# Altium project Domotica.PrjPcb
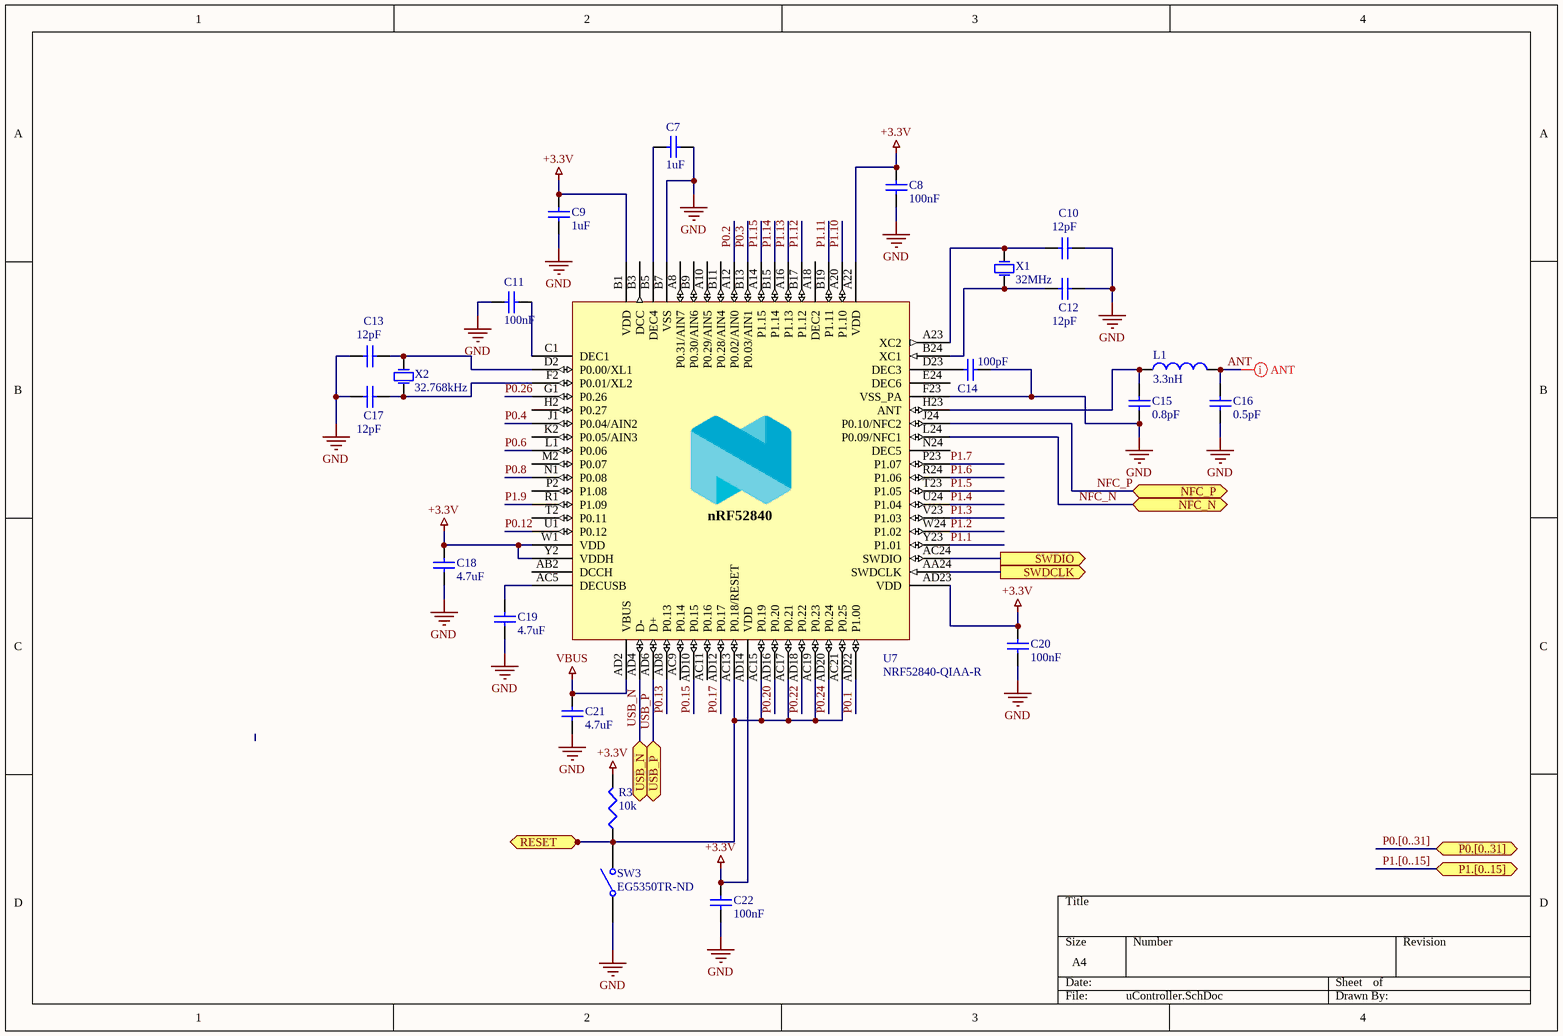
[diagram p0: uController.SchDoc]
3 sheets, 43 parts. Net scope: flat (ports and power ports of the same name join across sheets).
Board file: PCB.PcbDoc
Sheets:
  uController.SchDoc
  Power.SchDoc
  Output.SchDoc

## Sheet uController.SchDoc
size A4

### Parts
C7  value 1uF  (hidden comment: CL10A105KA8NNNC)
C8  value 100nF  (hidden comment: CL05A104KA5NNNC)
C9  value 1uF  (hidden comment: CL10A105KA8NNNC)
C10  value 12pF  (hidden comment: CL10C120JB8NNNC)
C11  value 100nF  (hidden comment: CL05A104KA5NNNC)
C12  value 12pF  (hidden comment: CL10C120JB8NNNC)
C13  value 12pF  (hidden comment: CL10C120JB8NNNC)
C14  value 100pF  (hidden comment: 885012206028)
C15  value 0.8pF  (hidden comment: CL10C0R8BB8NNNC)
C16  value 0.5pF  (hidden comment: CL10C0R5BB8NNNC)
C17  value 12pF  (hidden comment: CL10C120JB8NNNC)
C18  value 4.7uF  (hidden comment: CL21A475KAQNNNE)
C19  value 4.7uF  (hidden comment: CL21A475KAQNNNE)
C20  value 100nF  (hidden comment: CL05A104KA5NNNC)
C21  value 4.7uF  (hidden comment: CL21A475KAQNNNE)
C22  value 100nF  (hidden comment: CL05A104KA5NNNC)
L1  value 3.3nH  (hidden comment: CIH05T3N3SNC)
R3  value 10k  (hidden comment: RR0816P-103-D)
SW3  EG5350TR-ND  [SW1]
U7  NRF52840-QIAA-R
X1  value 32MHz  (hidden comment: NX2016SA-32MHZ-EXS00A-CS11336)
X2  value 32.768kHz  (hidden comment: Q0,032768-JTX210-9-20-T1-80K-LF)

### Ports
NFC_N, NFC_P, P0.[0..31] (bidir), P1.[0..15] (bidir), RESET (out), SWDCLK (out), SWDIO (out), USB_N, USB_P

### Nets
+3.3V: C8.1 C9.2 C18.2 C20.1 C22.1 R3.2 U7.A22(VDD) U7.AD14(VDD) U7.AD23(VDD) U7.B1(VDD) U7.W1(VDD) U7.Y2(VDDH)
GND: C7.1 C8.2 C9.1 C10.2 C11.2 C12.2 C13.1 C14.2 C15.1 C16.2 C17.1 C18.1 C19.1 C20.2 C21.1 C22.2 SW3.1 U7.B7(VSS) U7.F23(VSS_PA) X1.1(GND) X1.3(GND)
VBUS: C21.2 U7.AD2(VBUS)
ANT: C16.1 L1.2
NFC_N: U7.L24(P0.09/NFC1) ; port NFC_N
NFC_P: U7.J24(P0.10/NFC2) ; port NFC_P
P0.1: U7.AD22(P1.00)
P0.2: U7.A12(P0.02/AIN0)
P0.3: U7.B13(P0.03/AIN1)
P0.4: U7.J1(P0.04/AIN2)
P0.6: U7.L1(P0.06)
P0.8: U7.N1(P0.08)
P0.12: U7.U1(P0.12)
P0.13: U7.AD8(P0.13)
P0.15: U7.AD10(P0.15)
P0.17: U7.AD12(P0.17)
P0.20: U7.AD16(P0.20)
P0.22: U7.AD18(P0.22)
P0.24: U7.AD20(P0.24)
P0.26: U7.G1(P0.26)
P1.1: U7.Y23(P1.01)
P1.2: U7.W24(P1.02)
P1.3: U7.V23(P1.03)
P1.4: U7.U24(P1.04)
P1.5: U7.T23(P1.05)
P1.6: U7.R24(P1.06)
P1.7: U7.P23(P1.07)
P1.9: U7.R1(P1.09)
P1.10: U7.A20(P1.10)
P1.11: U7.B19(P1.11)
P1.12: U7.B17(P1.12)
P1.13: U7.A16(P1.13)
P1.14: U7.B15(P1.14)
P1.15: U7.A14(P1.15)
USB_N: U7.AD4(D-) ; port USB_N
USB_P: U7.AD6(D+) ; port USB_P
NetC7_2: C7.2 U7.B5(DEC4)
NetC10_1: C10.1 U7.A23(XC2) X1.4(OSC2)
NetC11_1: C11.1 U7.C1(DEC1)
NetC12_1: C12.1 U7.B24(XC1) X1.2(OSC1)
NetC13_2: C13.2 U7.D2(P0.00/XL1) X2.2(OSC2)
NetC14_1: C14.1 U7.D23(DEC3)
NetC15_2: C15.2 L1.1 U7.H23(ANT)
NetC17_2: C17.2 U7.F2(P0.01/XL2) X2.1(OSC1)
NetC19_2: C19.2 U7.AC5(DECUSB)
NetJ3_6: R3.1 SW3.3 U7.AC13(P0.18/RESET) U7.AC15(P0.19) U7.AC17(P0.21) U7.AC19(P0.23) U7.AC21(P0.25) ; port RESET
NetJ3_9: U7.AA24(SWDCLK) ; port SWDCLK
NetJ3_10: U7.AC24(SWDIO) ; port SWDIO

Not connected (* = marked no-connect by the designer): SW3 2 4; U7 A8(P0.31/AIN7) A10(P0.29/AIN5) A18(DEC2) AB2(DCCH) AC9(P0.14) AC11(P0.16) B3(DCC) B9(P0.30/AIN6) B11(P0.28/AIN4) E24(DEC6) H2(P0.27) K2(P0.05/AIN3) M2(P0.07) N24(DEC5) P2(P1.08) T2(P0.11)

### Buses and harness runs
bus P0.[0..31] = port P0.[0..31]
bus P1.[0..15] = port P1.[0..15]

### Layout directives
net class ANT: ANT

### Notes on the sheet
- (in symbol NRF52840-QIAA-R) nRF52840

### Library data of the parts
C7 C9 = CL10A105KA8NNNC: Cap Ceramic 1uF 25V X5R 10% SMD 0603 85C Paper T/R; Manufacturer: Samsung; Supplier 1: Digi-Key; Manufacturer Part Number: CL10A105KA8NNNC; Stock 1: 40000; Pricing 1: 1=0.1, 10=0.052, 100=0.0231, 500=0.0165, 1000=0.013 (USD); Mount: Surface Mount; Case/Package: 0603; Case Code (Metric): 1608; Case Code (Imperial): 0603; Material: Ceramic; Contact Plating: Tin; Min Operating Temperature: -55°C; Max Operating Temperature: 85°C; Capacitance: 1uF; Tolerance: 10%; Dielectric: X5R; Voltage: 25V; Voltage Rating (DC): 25V; Packaging: Tape and Reel; Package Quantity: 1; Voltage Rating: 25V; Length: 1.6mm; Height: 0.8mm; Depth: 0.8mm; Width: 0.031inch; Thickness: 0.035inch; Radiation Hardening: No; Lead Free: Lead Free; Supplier Part Number 1: 1276-1102-1-ND
C8 C11 C20 C22 = CL05A104KA5NNNC: Cap Ceramic 0.1uF 25V X5R 10% SMD 0402 85C Paper T/R; Manufacturer: Samsung; Supplier 1: Digi-Key; Manufacturer Part Number: CL05A104KA5NNNC; Stock 1: 100000; Pricing 1: 1=0.1, 10=0.04, 100=0.0176, 500=0.0126, 1000=0.0099, 2500=0.009, 5000=0.0083 (USD); Mount: Surface Mount; Case/Package: 0402; Case Code (Metric): 1005; Case Code (Imperial): 0402; Min Operating Temperature: -55°C; Max Operating Temperature: 85°C; Capacitance: 100nF; Packaging: Tape and Reel; Tolerance: 10%; Package Quantity: 1; Voltage Rating: 25V; Dielectric: X5R; Voltage: 25V; Voltage Rating (DC): 25V; Length: 1mm; Height: 0.5mm; Width: 0.02inch; Thickness: 0.022inch; Depth: 0.5mm; Radiation Hardening: No; Lead Free: Lead Free; Supplier Part Number 1: 1276-1043-1-ND
C10 C12 C13 C17 = CL10C120JB8NNNC: Cap Ceramic 12pF 50V C0G 5% SMD 0603 125C Paper T/R; Manufacturer: Samsung; Temperature Coefficient: 300ppm/°C; Supplier 1: Digi-Key; Manufacturer Part Number: CL10C120JB8NNNC; Stock 1: 40000; Pricing 1: 1=0.1, 10=0.07, 100=0.0314, 500=0.0224, 1000=0.0176 (USD); Mount: Surface Mount; Case/Package: 0603; Case Code (Metric): 1608; Case Code (Imperial): 0603; Material: Ceramic; Contact Plating: Tin; Min Operating Temperature: -55°C; Max Operating Temperature: 125°C; Tolerance: 5%; Capacitance: 12pF; Dielectric: C0G; Voltage: 50V; Voltage Rating (DC): 50V; Voltage Rating: 50V; Package Quantity: 1; Packaging: Tape and Reel; Length: 1.6mm; Height: 0.8mm; Depth: 0.8mm; Width: 0.031inch; Thickness: 0.035inch; Radiation Hardening: No; Lead Free: Lead Free; Supplier Part Number 1: 1276-1254-1-ND
C14 = 885012206028: Wurth Elektronik 0603 WCAP-CSGP 100pF Ceramic Multilayer Capacitor, 16 V dc, +125°C, X7R Dielectric, ±10%; Manufacturer: Wurth Electronics; Voltage Rating: 16V; Supplier 1: Digi-Key; Manufacturer Part Number: 885012206028; Stock 1: 4208; Pricing 1: 1=0.1, 10=0.021, 100=0.0192, 500=0.017 (USD); Mount: Surface Mount; Case/Package: 0603; Case Code (Metric): 1608; Case Code (Imperial): 0603; Min Operating Temperature: -55°C; Max Operating Temperature: 125°C; Packaging: Tape and Reel; Capacitance: 100pF; Tolerance: 10%; Length: 0.063inch; Width: 0.031inch; Thickness: 0.034inch; Supplier Part Number 1: 732-7947-1-ND
C15 = CL10C0R8BB8NNNC: Cap Ceramic 0.8pF 50V C0G 0.1pF SMD 0603 125C Paper T/R; Manufacturer: Samsung; Supplier 1: Digi-Key; Manufacturer Part Number: CL10C0R8BB8NNNC; Stock 1: 40000; Pricing 1: 1=0.1, 10=0.059, 100=0.0264, 500=0.0189, 1000=0.0148 (USD); Mount: Surface Mount; Case/Package: 0603; Case Code (Metric): 1608; Case Code (Imperial): 0603; Min Operating Temperature: -55°C; Max Operating Temperature: 125°C; Capacitance: 0.8pF; Packaging: Tape and Reel; Package Quantity: 1; Voltage Rating: 50V; Dielectric: C0G; Voltage Rating (DC): 50V; Length: 1.6mm; Height: 0.8mm; Width: 0.031inch; Thickness: 0.035inch; Depth: 0.8mm; Radiation Hardening: No; Supplier Part Number 1: 1276-2148-1-ND
C16 = CL10C0R5BB8NNNC: Cap Ceramic 0.5pF 50V C0G 0.1pF SMD 0603 125C Paper T/R; Manufacturer: Samsung; Dielectric: NP0; Temperature Coefficient: 300ppm/°C; Supplier 1: Digi-Key; Manufacturer Part Number: CL10C0R5BB8NNNC; Stock 1: 28897; Pricing 1: 1=0.1, 10=0.049, 100=0.0217, 500=0.0155, 1000=0.0122 (USD); Mount: Surface Mount; Case/Package: 0603; Case Code (Metric): 1608; Case Code (Imperial): 0603; Material: Ceramic; Contact Plating: Matte,Tin; Min Operating Temperature: -55°C; Max Operating Temperature: 125°C; Voltage Rating: 50V; Package Quantity: 1; Packaging: Tape and Reel; Capacitance: 0.5pF; Voltage: 50V; Length: 1.6mm; Height: 0.8mm; Width: 0.031inch; Thickness: 0.035inch; Depth: 0.8mm; Radiation Hardening: No; Supplier Part Number 1: 1276-1818-1-ND
C18 C19 C21 = CL21A475KAQNNNE: Cap Ceramic 4.7uF 25V X5R 10% SMD 0805 85C Embossed T/R; Manufacturer: Samsung; Supplier 1: Digi-Key; Manufacturer Part Number: CL21A475KAQNNNE; Stock 1: 20000; Pricing 1: 1=0.23, 10=0.158, 100=0.0802, 500=0.0549, 1000=0.0485 (USD); Mount: Surface Mount; Case/Package: 0805; Case Code (Metric): 2012; Case Code (Imperial): 0805; Min Operating Temperature: -55°C; Max Operating Temperature: 85°C; Package Quantity: 1; Packaging: Tape and Reel; Capacitance: 4.7uF; Tolerance: 10%; Voltage Rating: 25V; Dielectric: X5R; Voltage Rating (DC): 25V; Length: 2mm; Height: 1.25mm; Width: 0.049inch; Thickness: 0.055inch; Depth: 1.25mm; Radiation Hardening: No; Lead Free: Lead Free; Supplier Part Number 1: 1276-1244-1-ND
L1 = CIH05T3N3SNC: Inductor High Frequency Chip Multi-Layer 3.3nH 0.3nH 100MHz 8Q-Factor Ceramic 300mA 190mOhm DCR 0402 T/R; Manufacturer: Samsung; Shielding: Unshielded; DC Resistance (DCR): 190mR; Self Resonant Frequency: 6GHz; Supplier 1: Digi-Key; Manufacturer Part Number: CIH05T3N3SNC; Stock 1: 68140; Pricing 1: 1=0.1, 10=0.015, 100=0.0102, 500=0.0082, 1000=0.007, 2500=0.0063 (USD); Mount: Surface Mount; Case/Package: 0402; Case Code (Metric): 1005; Case Code (Imperial): 0402; Core Material: Ceramic; Min Operating Temperature: -55°C; Max Operating Temperature: 125°C; Packaging: Cut Tape; Current Rating: 300mA; Inductance: 3.3nh; Test Frequency: 100MHz; Max DC Current: 300mA; DC Current: 300mA; Military Standard: Not; Length: 0.039inch; Height: 0.55mm; Width: 0.02inch; Depth: 0.55mm; Radiation Hardening: No; Lead Free: Lead Free; Supplier Part Number 1: 1276-6294-1-ND
R3 = RR0816P-103-D: RES SMD 10K OHM 0.5% 1/16W 0603; Manufacturer: Susumu; Power (Watts): 0.063W, 1/16W; Temperature Coefficient: ±25ppm/°C; Supplier 1: Digi-Key; Manufacturer Part Number: RR0816P-103-D; RoHS: RoHS Compliant; Category: Resistors; Stock 1: 362461; Pricing 1: 1=0.09, 10=0.084, 100=0.0321, 1000=0.01412, 2500=0.01219 (EUR); Packaging: Cut Tape (CT); Part Status: Active; Tolerance: ±0.5%; Composition: Thin Film; Features: -; Operating Temperature: -55°C ~ 125°C; Package / Case: 0603 (1608 Metric); Supplier Device Package: -; Size / Dimension: 0.063" L x 0.032" W (1.60mm x 0.80mm); Height - Seated (Max): 0.020" (0.50mm); Failure Rate: -; ComponentLink1URL: http://www.susumu.co.jp/common/pdf/n_catalog_partition05_en.pdf; ComponentLink1Description: http://www.susumu.co.jp/common/pdf/n_catalog_partition05_en.pdf; Supplier Part Number 1: RR08P10.0KDCT-ND
SW3 = TL3305AF160QG: SWITCH TACTILE SPST-NO 50MA 12V; Manufacturer: E-Switch; Switch Function: Off-Mom; Contact Rating @ Voltage: 0.05A @ 12VDC; Actuator Type: Standard; Actuator Height off PCB, Vertical: 3.80mm; Actuator Orientation: Top Actuated; Outline: 4.50mm x 4.50mm; Illumination: Non-Illuminated; Operating Force: 160gf; Switch Travel: 0.20mm; Mechanical Life: 500,000 Cycles; Checked: 0; Supplier 1: Digi-Key; Manufacturer Part Number: TL3305AF160QG; RoHS: RoHS Compliant; Category: Switches; Stock 1: 50000; Pricing 1: 2000=0.08803, 6000=0.07294 (EUR); Packaging: Tape & Reel (TR); Part Status: Active; Circuit: SPST-NO; Mounting Type: Surface Mount; Actuator Length, Right Angle: -; Termination Style: Gull Wing; Illumination Type, Color: -; Illumination Voltage (Nominal): -; Ingress Protection: -; Features: -; Operating Temperature: -20°C ~ 70°C; Actuator Material: -; ComponentLink1URL: http://spec_sheets.e-switch.com/specs/P010468.pdf; ComponentLink1Description: http://spec_sheets.e-switch.com/specs/P010468.pdf; Supplier Part Number 1: EG5350TR-ND
U7 = NRF52840-QIAA-R: Manufacturer: Nordic Semiconductor; Supplier 1: Digi-Key; Manufacturer Part Number: NRF52840-QIAA-R; Stock 1: 13083; Pricing 1: 1=7.43, 10=6.815, 25=6.1952, 100=5.5755, 250=5.1109, 500=4.6463, 1000=4.1816 (USD); Supplier Part Number 1: 1490-1071-1-ND
X1 = NX2016SA-32MHZ-EXS00A-CS11336: Manufacturer: NDK; Supplier 1: Digi-Key; Manufacturer Part Number: NX2016SA-32MHZ-EXS00A-CS11336; Stock 1: 2762; Pricing 1: 1=0.64, 10=0.531, 50=0.4776, 100=0.4246, 500=0.4034, 1000=0.3397 (USD); Supplier Part Number 1: 644-1324-1-ND
X2 = Q0,032768-JTX210-9-20-T1-80K-LF: Manufacturer: Jauch; Supplier 1: Digi-Key; Manufacturer Part Number: Q0,032768-JTX210-9-20-T1-80K-LF; Stock 1: 0; Supplier Part Number 1: 1908-1304-2-ND

## Sheet Power.SchDoc
size A4
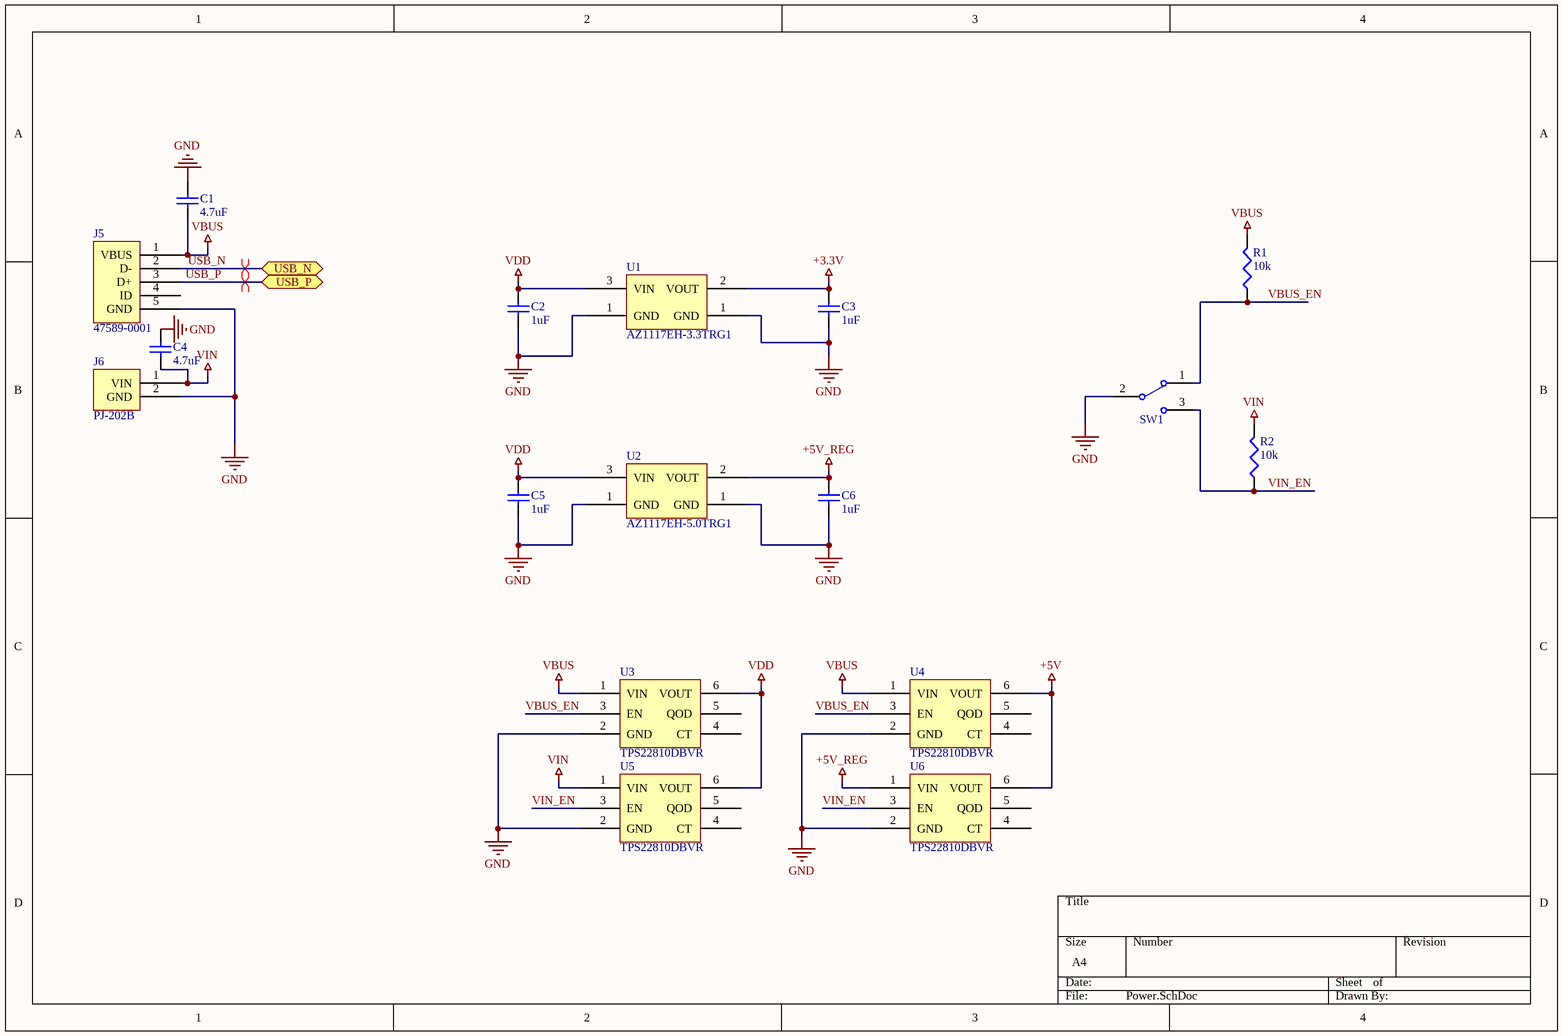
[diagram p1: Power.SchDoc]

### Parts
C1  value 4.7uF  [CAPC2013X14N]  (hidden comment: CL21A475KAQNNNE)
C2  value 1uF  [CAPC1608X09N_2]  (hidden comment: CL10A105KA8NNNC)
C3  value 1uF  [CAPC1608X09N_2]  (hidden comment: CL10A105KA8NNNC)
C4  value 4.7uF  [CAPC2013X14N]  (hidden comment: CL21A475KAQNNNE)
C5  value 1uF  [CAPC1608X09N_2]  (hidden comment: CL10A105KA8NNNC)
C6  value 1uF  [CAPC1608X09N_2]  (hidden comment: CL10A105KA8NNNC)
J5  47589-0001  [USB]
J6  PJ-202B  [POWER_JACK]
R1  value 10k  [RESC1608X05N]  (hidden comment: RR0816P-103-D)
R2  value 10k  [RESC1608X05N]  (hidden comment: RR0816P-103-D)
SW1  OS102011MS2QN1  [DIP5-SW]  (value not drawn)
U1  AZ1117EH-3.3TRG1  [SOT230P700X180-4N]
U2  AZ1117EH-5.0TRG1  [SOT230P700X180-4N]
U3  TPS22810DBVR  [SOT23127P600-8N-TPS22810DBVR]
U4  TPS22810DBVR  [SOT23127P600-8N-TPS22810DBVR]
U5  TPS22810DBVR  [SOT23127P600-8N-TPS22810DBVR]
U6  TPS22810DBVR  [SOT23127P600-8N-TPS22810DBVR]

### Ports
USB_N, USB_P

### Nets
+3.3V: C3.2 U1.2(VOUT)
+5V: U4.6(VOUT) U6.6(VOUT)
+5V_REG: C6.2 U2.2(VOUT) U6.1(VIN)
GND: C1.1 C2.1 C3.1 C4.1 C5.1 C6.1 J5.5(GND) J6.2(GND) J6.3(GND) SW1.2 U1.1(GND) U2.1(GND) U3.2(GND) U4.2(GND) U5.2(GND) U6.2(GND)
VBUS: C1.2 J5.1(VBUS) R1.2 U3.1(VIN) U4.1(VIN)
VDD: C2.2 C5.2 U1.3(VIN) U2.3(VIN) U3.6(VOUT) U5.6(VOUT)
VIN: C4.2 J6.1(VIN) R2.2 U5.1(VIN)
USB_N: J5.2(D-) ; port USB_N
USB_P: J5.3(D+) ; port USB_P
VBUS_EN: R1.1 SW1.1 U3.3(EN) U4.3(EN)
VIN_EN: R2.1 SW1.3 U5.3(EN) U6.3(EN)

Not connected (* = marked no-connect by the designer): J5 4(ID); U3 4(CT) 5(QOD); U4 4(CT) 5(QOD); U5 4(CT) 5(QOD); U6 4(CT) 5(QOD)

### Layout directives
differential pair; net class USB: USB_N, USB_P

### Library data of the parts
C1 C4 = CL21A475KAQNNNE: as C18 on sheet uController; Supplier 1: Digi-Key; Manufacturer Part Number: CL21A475KAQNNNE; Stock 1: 20000; Pricing 1: 1=0.23, 10=0.158, 100=0.0802, 500=0.0549, 1000=0.0485 (USD); Mount: Surface Mount; Case/Package: 0805; Case Code (Metric): 2012; Case Code (Imperial): 0805; Min Operating Temperature: -55°C; Max Operating Temperature: 85°C; Package Quantity: 1; Packaging: Tape and Reel; Capacitance: 4.7uF; Tolerance: 10%; Voltage Rating: 25V; Dielectric: X5R; Voltage Rating (DC): 25V; Length: 2mm; Height: 1.25mm; Width: 0.049inch; Thickness: 0.055inch; Depth: 1.25mm; Radiation Hardening: No; Lead Free: Lead Free; Supplier Part Number 1: 1276-1244-1-ND
C2 C3 C5 C6 = CL10A105KA8NNNC: as C7 on sheet uController; Supplier 1: Digi-Key; Manufacturer Part Number: CL10A105KA8NNNC; Stock 1: 40000; Pricing 1: 1=0.1, 10=0.052, 100=0.0231, 500=0.0165, 1000=0.013 (USD); Mount: Surface Mount; Case/Package: 0603; Case Code (Metric): 1608; Case Code (Imperial): 0603; Material: Ceramic; Contact Plating: Tin; Min Operating Temperature: -55°C; Max Operating Temperature: 85°C; Capacitance: 1uF; Tolerance: 10%; Dielectric: X5R; Voltage: 25V; Voltage Rating (DC): 25V; Packaging: Tape and Reel; Package Quantity: 1; Voltage Rating: 25V; Length: 1.6mm; Height: 0.8mm; Depth: 0.8mm; Width: 0.031inch; Thickness: 0.035inch; Radiation Hardening: No; Lead Free: Lead Free; Supplier Part Number 1: 1276-1102-1-ND
J5 = 47589-0001: MOLEX         47589-0001            MICRO USB, 2.0 TYPE AB, RECEPTACLE, SMT; Max Voltage Rating (AC): 100V; Gender: Female; Connector Type: Receptacle,USB; Number of Ports: 1; Number of Contacts: 5; Contact Resistance: 40mR; Current Rating: 1.8A; Voltage Rating (AC): 30V; USB Standard: USB 2.0; Pitch: 0.65mm; Checked: False; Supplier 1: Digi-Key; Manufacturer: Molex; Manufacturer Part Number: 47589-0001; Stock 1: 66825; Pricing 1: 1=0.74, 10=0.649, 25=0.6108, 50=0.5854, 100=0.56, 250=0.5091, 500=0.4582 (USD); Mount: PCB,Surface Mount; Weight: 0.01lb; Contact Plating: Gold; Contact Material: Copper,Copper Alloy; Number of Terminals: 5; Housing Material: Polymer; Colour: Black; Min Operating Temperature: -20°C; Max Operating Temperature: 85°C; Packaging: Tape and Reel; Termination: Solder; Orientation: Right Angle; Voltage Rating: 30V; Length: 8.65mm; Height: 0.25inch; Width: 0.25inch; Radiation Hardening: No; REACH SVHC: Unknown; Supplier Part Number 1: WM17143CT-ND
J6 = PJ-202B: PJ-202 Series 2.5 x 6.5 mm 16 V Horizontal Power Jack w/ Kinked Pins; Manufacturer: CUI; Shielding: Unshielded; Current Rating: 2.5A; Voltage Rating: 24V; Gender: Male; Insulation Resistance: 100MR; Number of Conductors: 2; Supplier 1: Digi-Key; Manufacturer Part Number: PJ-202B; Stock 1: 39597; Pricing 1: 1=0.61, 10=0.57, 25=0.5132, 50=0.456, 100=0.437, 250=0.399, 500=0.38, 1000=0.3135, 2500=0.285 (USD); Mount: Through Hole; Contact Plating: Nickel; Colour: Black; Contact Material: Copper; Housing Colour: Black; Housing Material: Thermoplastic; Min Operating Temperature: -25°C; Max Operating Temperature: 85°C; Package Quantity: 500; Packaging: Bulk; Termination: Through Hole; Connector Type: Jack; Orientation: Horizontal; Contact Gender: Male; Diameter: 2.5mm; Lead Free: Lead Free; Flammability Rating: UL94 V-0; Supplier Part Number 1: CP-202B-ND
R1 R2 = RR0816P-103-D: as R3 on sheet uController; Supplier 1: Digi-Key; Manufacturer Part Number: RR0816P-103-D; RoHS: RoHS Compliant; Category: Resistors; Stock 1: 362461; Pricing 1: 1=0.09, 10=0.084, 100=0.0321, 1000=0.01412, 2500=0.01219 (EUR); Packaging: Cut Tape (CT); Part Status: Active; Tolerance: ±0.5%; Composition: Thin Film; Features: -; Operating Temperature: -55°C ~ 125°C; Package / Case: 0603 (1608 Metric); Supplier Device Package: -; Size / Dimension: 0.063" L x 0.032" W (1.60mm x 0.80mm); Height - Seated (Max): 0.020" (0.50mm); Failure Rate: -; ComponentLink1URL: http://www.susumu.co.jp/common/pdf/n_catalog_partition05_en.pdf; ComponentLink1Description: http://www.susumu.co.jp/common/pdf/n_catalog_partition05_en.pdf; Supplier Part Number 1: RR08P10.0KDCT-ND
SW1 = OS102011MS2QN1: C & K COMPONENTS         OS102011MS2QN1             Slide Switch, SPDT, On-On, Through Hole, OS Series, 100 mA; Manufacturer: ITT C&K; Mechanical Life: 10000Cycles; Actuator Material: Acetal,Polyacetal,Polyoxymethylene; Max Current Rating: 100mA; Voltage Rating (DC): 12V; Contact Resistance: 20mR; Contact Style: Non-Shorting; Insulation Resistance: 100MR; Switch Travel: 2mm; Actuator Type: Standard; Actuator Length: 4mm; Supplier 1: Digi-Key; Manufacturer Part Number: OS102011MS2QN1; Stock 1: 29366; Pricing 1: 1=0.43, 10=0.413, 25=0.4048, 50=0.3616, 100=0.3444, 250=0.3358, 500=0.2841, 1000=0.2755, 5000=0.2411 (USD); Mount: PCB,Through Hole; Contact Material: Brass,Copper Alloy,Silver; Contact Plating: Gold,Silver; Housing Material: Resin; Min Operating Temperature: -30°C; Max Operating Temperature: 70°C; Throw Configuration: SPDT; Packaging: Bulk; Max Voltage Rating (DC): 12V; Package Quantity: 300; Contact Current Rating: 100mA; Current Rating: 100mA; Termination: PC Pins; Electrical Life: 10000Cycles; Orientation: Vertical; Switch Function: On-On; Length: 8.6mm; Depth: 4.3mm; Radiation Hardening: No; REACH SVHC: No SVHC; Lead Free: Lead Free; Supplier Part Number 1: CKN9565-ND
U1 = AZ1117EH-3.3TRG1: LDO Voltage Regulators LDO BJT HiCurr; Manufacturer: Diodes; Output Voltage: 3.3V; Output Current: 1A; Dropout Voltage: 1.1V; Number of Regulators: 1; Max Input Voltage: 13V; Operating Supply Current: 3.5mA; Power Supply Rejection Ratio (PSRR): 70dB; Polarity: Positive; Accuracy: 1%; Reference Voltage: 1.262V; Output Type: Fixed; Supplier 1: Digi-Key; Manufacturer Part Number: AZ1117EH-3.3TRG1; Stock 1: 97054; Pricing 1: 1=0.43, 10=0.321, 100=0.1815, 500=0.1202, 1000=0.0922 (USD); Mount: Surface Mount; Case/Package: TO-261-4; Number of Pins: 3; Weight: 0.000282oz; Contact Plating: Tin; Min Operating Temperature: -40°C; Max Operating Temperature: 125°C; Packaging: Tape and Reel; Number of Outputs: 1; Package Quantity: 4000; Quiescent Current: 3.5mA; Max Output Current: 1A; Lead Free: Lead Free; Supplier Part Number 1: AZ1117EH-3.3TRG1DICT-ND
U2 = AZ1117EH-5.0TRG1: LDO Voltage Regulators LDO BJT HiCurr 1A 1.15V to 12V; Manufacturer: Diodes; Output Voltage: 5V; Dropout Voltage: 1.1V; Number of Regulators: 1; Max Input Voltage: 13V; Operating Supply Current: 3.5mA; Power Supply Rejection Ratio (PSRR): 70dB; Polarity: Positive; Accuracy: 1%; Reference Voltage: 1.262V; Output Type: Fixed; Supplier 1: Digi-Key; Manufacturer Part Number: AZ1117EH-5.0TRG1; Stock 1: 41027; Pricing 1: 1=0.43, 10=0.321, 100=0.1815, 500=0.1202, 1000=0.0922 (USD); Mount: Surface Mount; Case/Package: TO-261-4; Number of Pins: 3; Weight: 0.000282oz; Min Operating Temperature: -40°C; Max Operating Temperature: 125°C; Packaging: Tape and Reel; Output Current: 1A; Number of Outputs: 1; Package Quantity: 4000; Quiescent Current: 3.5mA; Max Output Current: 1A; Supplier Part Number 1: AZ1117EH-5.0TRG1DICT-ND

## Sheet Output.SchDoc
size A4
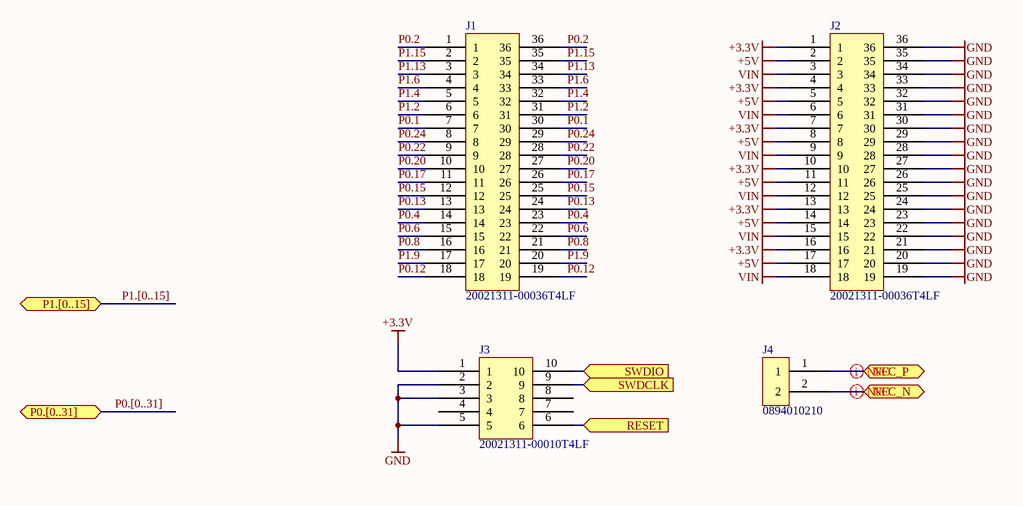
[diagram p2: Output.SchDoc]

### Parts
J1  20021311-00036T4LF  [DIP36]
J2  20021311-00036T4LF  [DIP36]
J3  20021311-00010T4LF  [DIP10]
J4  0894010210  [DIP2]

### Ports
NFC_N, NFC_P, P0.[0..31] (bidir), P1.[0..15], RESET (in), SWDCLK (in), SWDIO (in)

### Nets
+3.3V: J2.1 J2.4 J2.7 J2.10 J2.13 J2.16 J3.1
+5V: J2.2 J2.5 J2.8 J2.11 J2.14 J2.17
GND: J2.19 J2.20 J2.21 J2.22 J2.23 J2.24 J2.25 J2.26 J2.27 J2.28 J2.29 J2.30 J2.31 J2.32 J2.33 J2.34 J2.35 J2.36 J3.2 J3.3 J3.5
VIN: J2.3 J2.6 J2.9 J2.12 J2.15 J2.18
NFC_N: J4.2 ; port NFC_N
NFC_P: J4.1 ; port NFC_P
P0.1: J1.7 J1.30
P0.2: J1.1 J1.36
P0.4: J1.14 J1.23
P0.6: J1.15 J1.22
P0.8: J1.16 J1.21
P0.12: J1.18 J1.19
P0.13: J1.13 J1.24
P0.15: J1.12 J1.25
P0.17: J1.11 J1.26
P0.20: J1.10 J1.27
P0.22: J1.9 J1.28
P0.24: J1.8 J1.29
P1.2: J1.6 J1.31
P1.4: J1.5 J1.32
P1.6: J1.4 J1.33
P1.9: J1.17 J1.20
P1.13: J1.3 J1.34
P1.15: J1.2 J1.35
NetJ3_6: J3.6 ; port RESET
NetJ3_9: J3.9 ; port SWDCLK
NetJ3_10: J3.10 ; port SWDIO

Not connected (* = marked no-connect by the designer): J3 4 7 8

### Buses and harness runs
bus P0.[0..31] = port P0.[0..31]
bus P1.[0..15] = port P1.[0..15]

### Layout directives
differential pair; net class NFC: NFC_N, NFC_P

### Library data of the parts
J1 J2 = 20021311-00036T4LF: 36 Position Receptacle Connector 0.050" (1.27mm) Through Hole Gold; Manufacturer: Amphenol FCI; Current Rating: 1A; Voltage Rating: 125V; Contact Resistance: 30mR; Number of Positions: 36; Connector Type: Receptacle,Socket; Gender: Female; Row Spacing: 0.05inch; CHECKED: false; Supplier 1: Digi-Key; Manufacturer Part Number: 20021311-00036T4LF; Stock 1: 859; Pricing 1: 1=2.66, 25=2.3368, 100=2.1242, 500=1.8056, 1000=1.5401, 5000=1.3807 (USD); Mount: Through Hole; Contact Plating: Gold; Contact Material: Copper Alloy; Colour: Black; Housing Material: Plastic; Min Operating Temperature: -40°C; Max Operating Temperature: 85°C; Packaging: Rail/Tube; Number of Rows: 2; Package Quantity: 25; Termination: Solder; Number of Contacts: 36; Max Voltage Rating (AC): 125V; Orientation: Straight; Length: 21.59mm; Pitch: 1.27mm; Depth: 3mm; Supplier Part Number 1: 609-3765-ND
J3 = 20021311-00010T4LF: 10 Position Receptacle Connector 0.050" (1.27mm) Through Hole Gold; Manufacturer: Amphenol FCI; Contact Resistance: 30mR; Current Rating: 1A; Voltage Rating: 125V; Number of Positions: 10; Connector Type: Receptacle,Socket; Insulation Resistance: 1GR; Row Spacing: 0.05inch; Checked: False; Supplier 1: Digi-Key; Manufacturer Part Number: 20021311-00010T4LF; Stock 1: 21801; Pricing 1: 1=1.03, 86=0.8154, 172=0.7799, 516=0.6381, 1032=0.5672, 5074=0.4963, 10062=0.4715 (USD); Mount: Through Hole; Contact Plating: Gold; Contact Material: Copper,Copper Alloy,Gold; Colour: Black; Housing Material: Thermoplastic; Min Operating Temperature: -55°C; Max Operating Temperature: 125°C; Number of Rows: 2; Packaging: Rail/Tube; Package Quantity: 86; Termination: Solder; Max Voltage Rating (AC): 125V; Number of Contacts: 10; Gender: Receptacle; Orientation: Straight; Contact Gender: Male; Length: 5.08mm; Pitch: 1.27mm; Depth: 3mm; Termination Post Length: 2.4mm; REACH SVHC: No SVHC; Lead Free: Lead Free; Flammability Rating: UL94 V-0; Supplier Part Number 1: 609-3754-ND
J4 = 0894010210: Conn Shrouded Header HDR 2 POS 2mm Solder RA Thru-Hole Bag; Manufacturer: Molex; Number of Positions: 2; Connector Type: Male Pin; Checked: False; Supplier 1: Digi-Key; Manufacturer Part Number: 0894010210; Stock 1: 9337; Pricing 1: 1=0.13, 10=0.123, 100=0.0757, 500=0.0626, 1000=0.0548, 5000=0.047, 10000=0.0457 (USD); Mount: Through Hole; Contact Material: Brass; Contact Plating: Copper,Tin; Colour: Natural; Housing Material: Nylon; Housing Colour: Natural; Min Operating Temperature: -25°C; Max Operating Temperature: 85°C; Number of Rows: 1; Package Quantity: 9000; Packaging: Bulk; Termination: Solder; Number of Contacts: 2; Orientation: Right Angle; Length: 6mm; Pitch: 2mm; Depth: 7.6mm; Radiation Hardening: No; Supplier Part Number 1: WM14854-ND

## Nets that join several sheets
+3.3V: uController (12 pins), Power (C3.2 U1.2), Output (7 pins)
+5V: Power (U4.6 U6.6), Output (6 pins)
GND: uController (21 pins), Power (16 pins), Output (21 pins)
VBUS: uController (C21.2 U7.AD2), Power (5 pins)
VIN: Power (C4.2 J6.1 R2.2 U5.1), Output (6 pins)
NetJ3_6: uController (7 pins), Output (J3.6)
NetJ3_9: uController (U7.AA24), Output (J3.9)
NetJ3_10: uController (U7.AC24), Output (J3.10)
NFC_N: uController (U7.L24), Output (J4.2)
NFC_P: uController (U7.J24), Output (J4.1)
P0.1: uController (U7.AD22), Output (J1.7 J1.30)
P0.2: uController (U7.A12), Output (J1.1 J1.36)
P0.4: uController (U7.J1), Output (J1.14 J1.23)
P0.6: uController (U7.L1), Output (J1.15 J1.22)
P0.8: uController (U7.N1), Output (J1.16 J1.21)
P0.12: uController (U7.U1), Output (J1.18 J1.19)
P0.13: uController (U7.AD8), Output (J1.13 J1.24)
P0.15: uController (U7.AD10), Output (J1.12 J1.25)
P0.17: uController (U7.AD12), Output (J1.11 J1.26)
P0.20: uController (U7.AD16), Output (J1.10 J1.27)
P0.22: uController (U7.AD18), Output (J1.9 J1.28)
P0.24: uController (U7.AD20), Output (J1.8 J1.29)
P1.2: uController (U7.W24), Output (J1.6 J1.31)
P1.4: uController (U7.U24), Output (J1.5 J1.32)
P1.6: uController (U7.R24), Output (J1.4 J1.33)
P1.9: uController (U7.R1), Output (J1.17 J1.20)
P1.13: uController (U7.A16), Output (J1.3 J1.34)
P1.15: uController (U7.A14), Output (J1.2 J1.35)
USB_N: uController (U7.AD4), Power (J5.2)
USB_P: uController (U7.AD6), Power (J5.3)